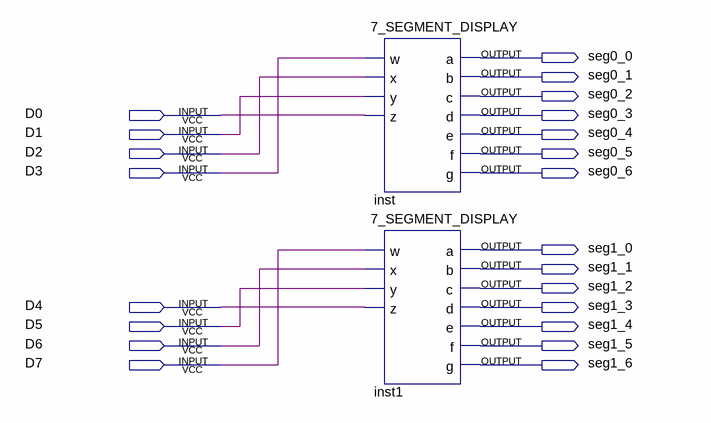
[diagram p0: schematic sheet]
// Quartus schematic 8_BIT_7_SEG.bdf as structural Verilog: 2 symbols, 22 pins
module \8_BIT_7_SEG  (
  input  D0,
  input  D1,
  input  D2,
  input  D3,
  input  D4,
  input  D5,
  input  D6,
  input  D7,
  output seg0_0,
  output seg0_1,
  output seg0_2,
  output seg0_3,
  output seg0_4,
  output seg0_5,
  output seg0_6,
  output seg1_0,
  output seg1_1,
  output seg1_2,
  output seg1_3,
  output seg1_4,
  output seg1_5,
  output seg1_6
);

  \7_SEGMENT_DISPLAY  inst (
    .w(D3), .x(D2), .y(D1), .z(D0), .a(seg0_0), .b(seg0_1), .c(seg0_2), .d(seg0_3), .e(seg0_4), .f(seg0_5),
    .g(seg0_6));
  \7_SEGMENT_DISPLAY  inst1 (
    .w(D7), .x(D6), .y(D5), .z(D4), .a(seg1_0), .b(seg1_1), .c(seg1_2), .d(seg1_3), .e(seg1_4), .f(seg1_5),
    .g(seg1_6));
endmodule
